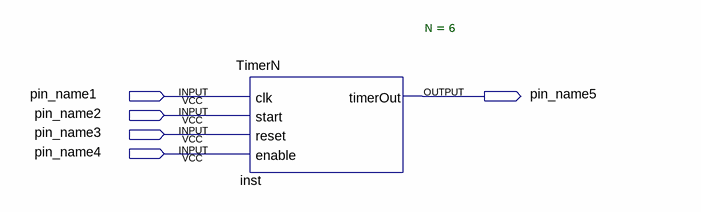
[diagram p0: schematic sheet]
// Quartus schematic TimerN_Demo.bdf as structural Verilog: 1 symbols, 5 pins
module TimerN_Demo (
  input  pin_name1,
  input  pin_name2,
  input  pin_name3,
  input  pin_name4,
  output pin_name5
);

  TimerN #(.N(6)) inst (
    .clk(pin_name1), .start(pin_name2), .reset(pin_name3), .enable(pin_name4), .timerOut(pin_name5));
endmodule
